# Altium project PCB_Project.PrjPcb (part 2 of 4)
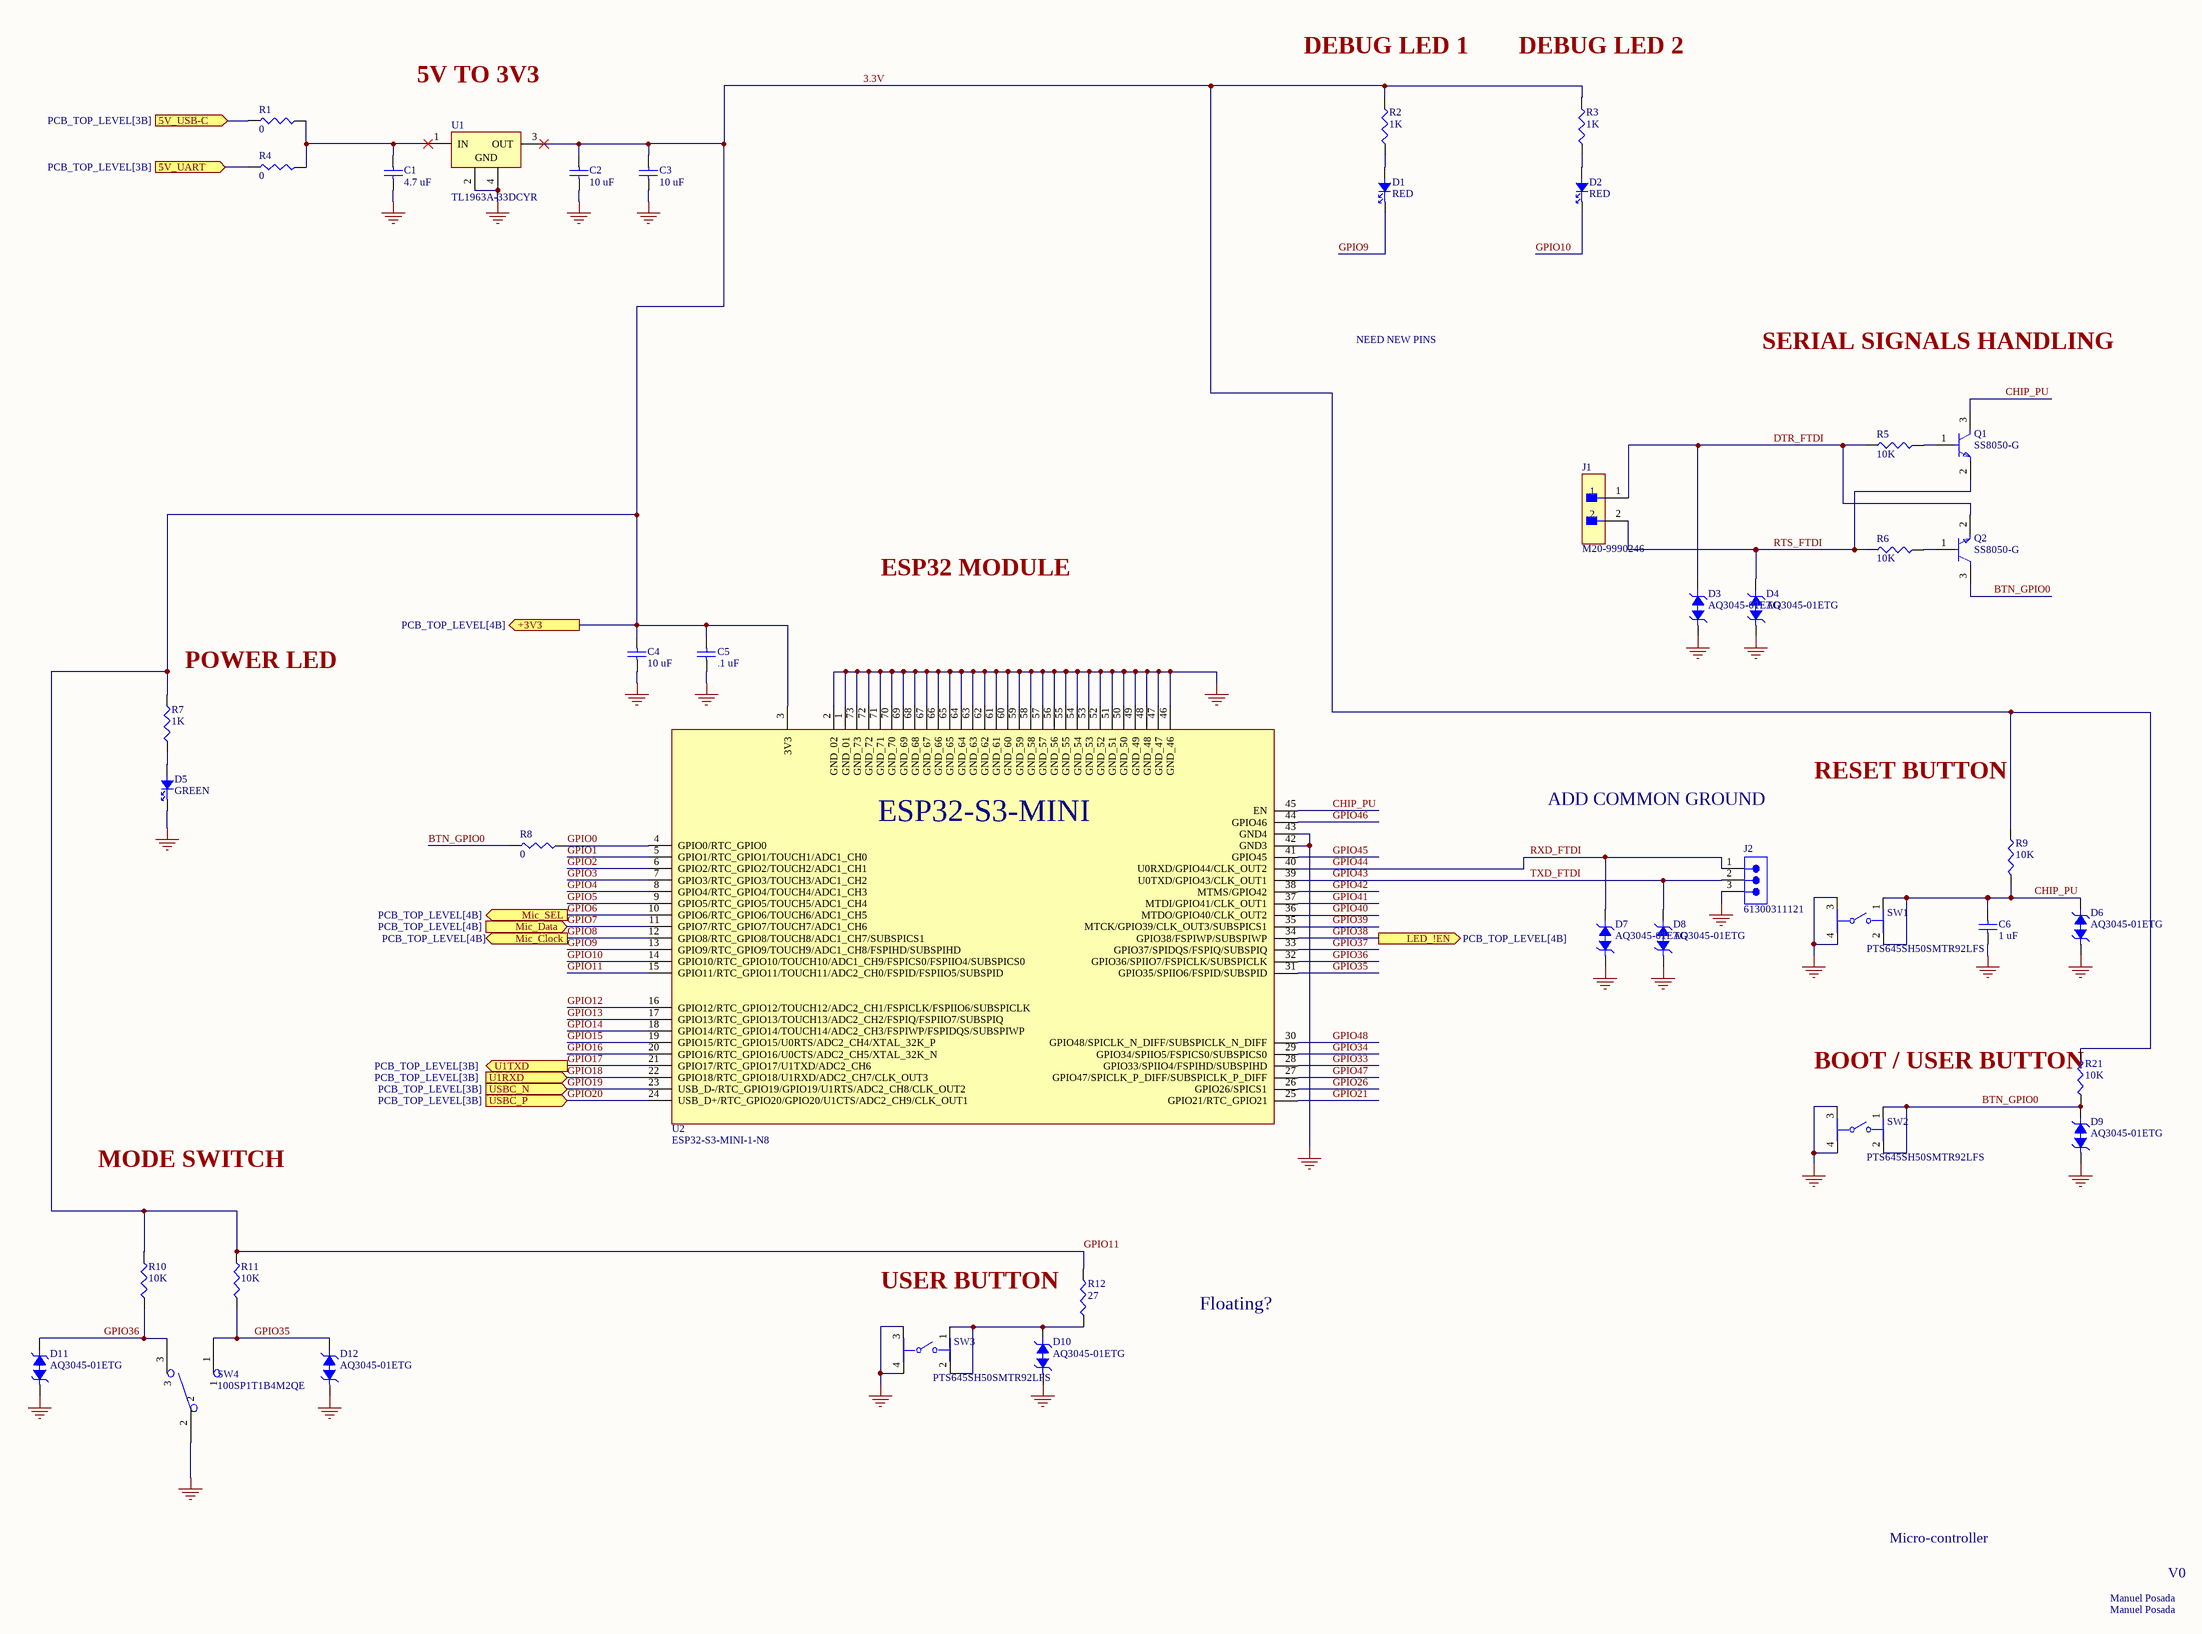
[diagram p6: Micro_controller.SchDoc]

## Sheet Micro_controller.SchDoc (continued)
### Library data of the parts
C1 = CL21A475KAQNNNE: 25V 4.7uF X5R ±10% 0805 Multilayer Ceramic Capacitors MLCC - SMD/SMT ROHS; Manufacturer: Samsung Electro-Mechanics; Value: 4.7µF; Supplier: DigiKey; Supplier Part Number: 1276-1244-6-ND; Manufacturer Part Number: CL21A475KAQNNNE; RoHS: Compliant; Category: Ceramic Capacitors; Stock: 1914384; Pricing: 1=0.1, 10=0.057, 50=0.039, 100=0.0337, 500=0.02474, 1000=0.02199 (USD); Case/Package: 0805; Case Code (Imperial): 0805; Case Code (Metric): 2012; China RoHS: Compliant; Country of Origin: Mainland China, Philippines, South Korea; Depth: 1.25mm; Dielectric: X5R; Dielectric Material: Ceramic; Export Control Classification Number (ECCN) Code: EAR99; Height: 1.4mm; Harmonized Tariff Schedule (HTS) Code: 8532.24.00.20; Introduction Date: 2009-10-29; Lead Free: Lead Free; Length: 2mm; Lifecycle Status: Production; Material: Ceramic; Max Operating Temperature: 85°C; Min Operating Temperature: -55°C; Mounting Technology: Surface Mount; Number of Terminals: 2; Packaging: Tape & Reel; Radiation Hardening: No; REACH SVHC: Yes; Schedule B: 8532240020, 8532240020|8532240020|8532240020|8532240020|8532240020|8532240020|8532240020|8532240020|8532240020|8532240020|8532240020|8532240020|8532240020, 8532240020|8532240020|8532240020|8532240020|8532240020|8532240020|8532240020|8532240020|8532240020|8532240020|8532240020|8532240020|8532240020|8532240020, 8532240020|8532240020|8532240020|8532240020|8532240020|8532240020|8532240020|8532240020|8532240020|8532240020|8532240020|8532240020|8532240020|8532240020|8532240020; Thickness: 1.397mm; Tolerance: 10%; Voltage Rating: 25V; Voltage Rating (DC): 25V; Width: 1.25mm; ComponentLink1URL: https://datasheet.octopart.com:443/CL21A475KAQNNNE-Samsung-Electro-Mechanics-datasheet-136322593.pdf?src-supplier=IHS; ComponentLink1Description: https://datasheet.octopart.com:443/CL21A475KAQNNNE-Samsung-Electro-Mechanics-datasheet-136322593.pdf?src-supplier=IHS; ComponentLink2URL: https://datasheet.octopart.com:443/CL21A475KAQNNNE-Samsung-Electro-Mechanics-datasheet-11797909.pdf?src-supplier=Future+Electronics; ComponentLink2Description: https://datasheet.octopart.com:443/CL21A475KAQNNNE-Samsung-Electro-Mechanics-datasheet-11797909.pdf?src-supplier=Future+Electronics; ComponentLink3URL: https://datasheet.octopart.com:443/CL21A475KAQNNNE-Samsung-Electro-Mechanics-datasheet-110333979.pdf?src-supplier=Future+Electronics; ComponentLink3Description: https://datasheet.octopart.com:443/CL21A475KAQNNNE-Samsung-Electro-Mechanics-datasheet-110333979.pdf?src-supplier=Future+Electronics; ComponentLink4URL: https://datasheet.octopart.com:443/CL21A475KAQNNNE-Samsung-Electro-Mechanics-datasheet-81462145.pdf?src-supplier=Future+Electronics; ComponentLink4Description: https://datasheet.octopart.com:443/CL21A475KAQNNNE-Samsung-Electro-Mechanics-datasheet-81462145.pdf?src-supplier=Future+Electronics; ComponentLink5URL: https://datasheet.octopart.com:443/CL21A475KAQNNNE-Samsung-datasheet-48647566.pdf?src-supplier=Future+Electronics; ComponentLink5Description: https://datasheet.octopart.com:443/CL21A475KAQNNNE-Samsung-datasheet-48647566.pdf?src-supplier=Future+Electronics; ComponentLink6URL: https://datasheet.octopart.com:443/CL21A475KAQNNNE-Samsung-datasheet-42485236.pdf?src-supplier=Future+Electronics; ComponentLink6Description: https://datasheet.octopart.com:443/CL21A475KAQNNNE-Samsung-datasheet-42485236.pdf?src-supplier=Future+Electronics; ComponentLink7URL: https://datasheet.octopart.com:443/CL21A475KAQNNNE-Samsung-Electro-Mechanics-datasheet-149154248.pdf?src-supplier=Future+Electronics; ComponentLink7Description: https://datasheet.octopart.com:443/CL21A475KAQNNNE-Samsung-Electro-Mechanics-datasheet-149154248.pdf?src-supplier=Future+Electronics; ComponentLink8URL: https://datasheet.octopart.com/CL21A475KAQNNNE-Samsung-Electro-Mechanics-datasheet-97040617.pdf; ComponentLink8Description: https://datasheet.octopart.com/CL21A475KAQNNNE-Samsung-Electro-Mechanics-datasheet-97040617.pdf; ComponentLink9URL: https://datasheet.octopart.com/CL21A475KAQNNNE-Samsung-Electro-Mechanics-datasheet-8324245.pdf; ComponentLink9Description: https://datasheet.octopart.com/CL21A475KAQNNNE-Samsung-Electro-Mechanics-datasheet-8324245.pdf; ComponentLink10URL: https://datasheet.octopart.com/General-Multilayer-Ceramic-Capacitors-Samsung-datasheet-family-111.pdf; ComponentLink10Description: https://datasheet.octopart.com/General-Multilayer-Ceramic-Capacitors-Samsung-datasheet-family-111.pdf; ComponentLink11URL: https://datasheet.octopart.com:443/CL21A475KAQNNNE-Samsung-datasheet-59220082.pdf?src-supplier=TME; ComponentLink11Description: https://datasheet.octopart.com:443/CL21A475KAQNNNE-Samsung-datasheet-59220082.pdf?src-supplier=TME; ComponentLink12URL: http://sigma.octopart.com:80/rohs_certificate/General-Multilayer-Ceramic-Capacitors-Samsung-family-110.pdf?src-supplier=Compliance+Statements; ComponentLink12Description: http://sigma.octopart.com:80/rohs_certificate/General-Multilayer-Ceramic-Capacitors-Samsung-family-110.pdf?src-supplier=Compliance+Statements; ComponentLink13URL: http://sigma.octopart.com:80/rohs_statement/General-Multilayer-Ceramic-Capacitors-Samsung-family-132.pdf?src-supplier=Compliance+Statements; ComponentLink13Description: http://sigma.octopart.com:80/rohs_statement/General-Multilayer-Ceramic-Capacitors-Samsung-family-132.pdf?src-supplier=Compliance+Statements; ComponentLink14URL: http://sigma.octopart.com:80/reach_statement/General-Multilayer-Ceramic-Capacitors-Samsung-family-133.pdf?src-supplier=Compliance+Statements; ComponentLink14Description: http://sigma.octopart.com:80/reach_statement/General-Multilayer-Ceramic-Capacitors-Samsung-family-133.pdf?src-supplier=Compliance+Statements
C2-C4 = CL21B106KOQNNNE: 16V 10uF X7R ±10% 0805 Multilayer Ceramic Capacitors MLCC - SMD/SMT ROHS; Manufacturer: Samsung Electro-Mechanics; Value: 10µF; Supplier: DigiKey; Supplier Part Number: 1276-2872-6-ND; Manufacturer Part Number: CL21B106KOQNNNE; RoHS: Compliant; Category: Ceramic Capacitors; Stock: 2199280; Pricing: 1=0.08, 10=0.035 (USD); Case/Package: 0805; Case Code (Imperial): 0805; Case Code (Metric): 2012; China RoHS: Compliant; Contact Plating: Tin; Country of Origin: Mainland China, Philippines, South Korea; Depth: 1.25mm; Dielectric: X7R; Dielectric Material: Ceramic; Export Control Classification Number (ECCN) Code: EAR99; Height: 1.4mm; Harmonized Tariff Schedule (HTS) Code: 8532.24.00.20; Introduction Date: 2010-04-09; Length: 2mm; Lifecycle Status: Production; Material: Ceramic; Max Operating Temperature: 125°C; Min Operating Temperature: -55°C; Mounting Technology: Surface Mount; Number of Terminals: 2; Radiation Hardening: No; REACH SVHC: Yes; Schedule B: 8532240020, 8532240020|8532240020, 8532240020|8532240020|8532240020, 8532240020|8532240020|8532240020|8532240020; Thickness: 1.397mm; Tolerance: 10%; Voltage: 16V; Voltage Rating: 16V; Voltage Rating (DC): 16V; Width: 1.25mm; ComponentLink1URL: https://datasheet.octopart.com:443/CL21B106KOQNNNE-Samsung-Electro-Mechanics-datasheet-136482503.pdf?src-supplier=IHS; ComponentLink1Description: https://datasheet.octopart.com:443/CL21B106KOQNNNE-Samsung-Electro-Mechanics-datasheet-136482503.pdf?src-supplier=IHS; ComponentLink2URL: https://datasheet.octopart.com:443/CL21B106KOQNNNE-Samsung-Electro-Mechanics-datasheet-116891046.pdf?src-supplier=Future+Electronics; ComponentLink2Description: https://datasheet.octopart.com:443/CL21B106KOQNNNE-Samsung-Electro-Mechanics-datasheet-116891046.pdf?src-supplier=Future+Electronics; ComponentLink3URL: https://datasheet.octopart.com:443/CL21B106KOQNNNE-Samsung-Electro-Mechanics-datasheet-81462191.pdf?src-supplier=Future+Electronics; ComponentLink3Description: https://datasheet.octopart.com:443/CL21B106KOQNNNE-Samsung-Electro-Mechanics-datasheet-81462191.pdf?src-supplier=Future+Electronics; ComponentLink4URL: https://datasheet.octopart.com:443/CL21B106KOQNNNE-Samsung-datasheet-12530662.pdf?src-supplier=Future+Electronics; ComponentLink4Description: https://datasheet.octopart.com:443/CL21B106KOQNNNE-Samsung-datasheet-12530662.pdf?src-supplier=Future+Electronics; ComponentLink5URL: https://datasheet.octopart.com:443/CL21B106KOQNNNE-Samsung-datasheet-26669285.pdf?src-supplier=Future+Electronics; ComponentLink5Description: https://datasheet.octopart.com:443/CL21B106KOQNNNE-Samsung-datasheet-26669285.pdf?src-supplier=Future+Electronics; ComponentLink6URL: https://datasheet.octopart.com:443/CL21B106KOQNNNE-Samsung-Electro-Mechanics-datasheet-149045986.pdf?src-supplier=Future+Electronics; ComponentLink6Description: https://datasheet.octopart.com:443/CL21B106KOQNNNE-Samsung-Electro-Mechanics-datasheet-149045986.pdf?src-supplier=Future+Electronics; ComponentLink7URL: https://datasheet.octopart.com/CL21B106KOQNNNE-Samsung-Electro-Mechanics-datasheet-97040617.pdf; ComponentLink7Description: https://datasheet.octopart.com/CL21B106KOQNNNE-Samsung-Electro-Mechanics-datasheet-97040617.pdf; ComponentLink8URL: https://datasheet.octopart.com/CL21B106KOQNNNE-Samsung-Electro-Mechanics-datasheet-8324245.pdf; ComponentLink8Description: https://datasheet.octopart.com/CL21B106KOQNNNE-Samsung-Electro-Mechanics-datasheet-8324245.pdf; ComponentLink9URL: https://datasheet.octopart.com:443/CL21B106KOQNNNE-Samsung-Electro-Mechanics-datasheet-11806859.pdf?src-supplier=Arrow+Electronics; ComponentLink9Description: https://datasheet.octopart.com:443/CL21B106KOQNNNE-Samsung-Electro-Mechanics-datasheet-11806859.pdf?src-supplier=Arrow+Electronics; ComponentLink10URL: https://datasheet.octopart.com:443/CL21B106KOQNNNE-Samsung-datasheet-8326407.pdf?src-supplier=TME; ComponentLink10Description: https://datasheet.octopart.com:443/CL21B106KOQNNNE-Samsung-datasheet-8326407.pdf?src-supplier=TME
C5 = CL21B104KBCNNNC: 50V 100nF X7R ±10% 0805 Multilayer Ceramic Capacitors MLCC - SMD/SMT ROHS; Manufacturer: Samsung Electro-Mechanics; Supplier: DigiKey; Supplier Part Number: 1276-1003-6-ND; Manufacturer Part Number: CL21B104KBCNNNC; RoHS: Compliant; Category: Ceramic Capacitors; Stock: 2859375; Pricing: 1=0.08, 10=0.006 (USD); Value: 100nF; Case/Package: 0805; Case Code (Imperial): 0805; Case Code (Metric): 2012; China RoHS: Compliant; Contact Plating: Tin; Country of Origin: Mainland China, Philippines, South Korea; Depth: 1.25mm; Dielectric: X7R; Dielectric Material: Ceramic; Export Control Classification Number (ECCN) Code: EAR99; Height: 950µm; Harmonized Tariff Schedule (HTS) Code: 8532.24.00.20; Introduction Date: 2009-07-27; Lead Free: Lead Free; Length: 2mm; Lifecycle Status: Production; Material: Ceramic; Max Operating Temperature: 125°C; Min Operating Temperature: -55°C; Mounting Technology: Surface Mount; Number of Terminals: 2; Radiation Hardening: No; REACH SVHC: Yes; Schedule B: 8532240020, 8532240020|8532240020, 8532240020|8532240020|8532240020, 8532240020|8532240020|8532240020|8532240020; Thickness: 939.8µm; Tolerance: 10%; Voltage: 50V; Voltage Rating: 50V; Voltage Rating (DC): 50V; Width: 1.25mm; ComponentLink1URL: https://datasheet.octopart.com:443/CL21B104KBCNNNC-Samsung-Electro-Mechanics-datasheet-137745078.pdf?src-supplier=IHS; ComponentLink1Description: https://datasheet.octopart.com:443/CL21B104KBCNNNC-Samsung-Electro-Mechanics-datasheet-137745078.pdf?src-supplier=IHS; ComponentLink2URL: https://datasheet.octopart.com/CL21B104KBCNNNC-Samsung-Electro-Mechanics-datasheet-8324245.pdf; ComponentLink2Description: https://datasheet.octopart.com/CL21B104KBCNNNC-Samsung-Electro-Mechanics-datasheet-8324245.pdf; ComponentLink3URL: https://datasheet.octopart.com/CL21B104KBCNNNC-Samsung-Electro-Mechanics-datasheet-97040617.pdf; ComponentLink3Description: https://datasheet.octopart.com/CL21B104KBCNNNC-Samsung-Electro-Mechanics-datasheet-97040617.pdf; ComponentLink4URL: https://datasheet.octopart.com:443/CL21B104KBCNNNC-Samsung-Electro-Mechanics-datasheet-11548950.pdf?src-supplier=Future+Electronics; ComponentLink4Description: https://datasheet.octopart.com:443/CL21B104KBCNNNC-Samsung-Electro-Mechanics-datasheet-11548950.pdf?src-supplier=Future+Electronics; ComponentLink5URL: https://datasheet.octopart.com:443/CL21B104KBCNNNC-Samsung-Electro-Mechanics-datasheet-116891032.pdf?src-supplier=Future+Electronics; ComponentLink5Description: https://datasheet.octopart.com:443/CL21B104KBCNNNC-Samsung-Electro-Mechanics-datasheet-116891032.pdf?src-supplier=Future+Electronics; ComponentLink6URL: https://datasheet.octopart.com:443/CL21B104KBCNNNC-Samsung-Electro-Mechanics-datasheet-81462175.pdf?src-supplier=Future+Electronics; ComponentLink6Description: https://datasheet.octopart.com:443/CL21B104KBCNNNC-Samsung-Electro-Mechanics-datasheet-81462175.pdf?src-supplier=Future+Electronics; ComponentLink7URL: https://datasheet.octopart.com:443/CL21B104KBCNNNC-Samsung-datasheet-42485244.pdf?src-supplier=Future+Electronics; ComponentLink7Description: https://datasheet.octopart.com:443/CL21B104KBCNNNC-Samsung-datasheet-42485244.pdf?src-supplier=Future+Electronics; ComponentLink8URL: https://datasheet.octopart.com:443/CL21B104KBCNNNC-Samsung-Electro-Mechanics-datasheet-149045937.pdf?src-supplier=Future+Electronics; ComponentLink8Description: https://datasheet.octopart.com:443/CL21B104KBCNNNC-Samsung-Electro-Mechanics-datasheet-149045937.pdf?src-supplier=Future+Electronics; ComponentLink9URL: https://datasheet.octopart.com:443/CL21B104KBCNNNC-Samsung-datasheet-8326407.pdf?src-supplier=TME; ComponentLink9Description: https://datasheet.octopart.com:443/CL21B104KBCNNNC-Samsung-datasheet-8326407.pdf?src-supplier=TME
C6 = CL21B105KBFNNNE: 50V 1uF X7R ±10% 0805 Multilayer Ceramic Capacitors MLCC - SMD/SMT ROHS; Manufacturer: Samsung Electro-Mechanics; Value: 1µF; Supplier: DigiKey; Supplier Part Number: 1276-1029-6-ND; Manufacturer Part Number: CL21B105KBFNNNE; RoHS: Compliant; Category: Ceramic Capacitors; Stock: 1740686; Pricing: 1=0.08, 10=0.013 (USD); Case/Package: 0805; Case Code (Imperial): 0805; Case Code (Metric): 2012; China RoHS: Compliant; Country of Origin: Mainland China, Philippines, South Korea; Depth: 1.25mm; Dielectric: X7R; Dielectric Material: Ceramic; Export Control Classification Number (ECCN) Code: EAR99; Height: 1.35mm; Harmonized Tariff Schedule (HTS) Code: 8532.24.00.20; Introduction Date: 2010-07-30; Length: 2mm; Lifecycle Status: Production; Material: Ceramic; Max Operating Temperature: 125°C; Min Operating Temperature: -55°C; Mounting Technology: Surface Mount; Number of Terminals: 2; Radiation Hardening: No; REACH SVHC: Yes; Schedule B: 8532240020, 8532240020|8532240020, 8532240020|8532240020|8532240020, 8532240020|8532240020|8532240020|8532240020; Thickness: 1.3462mm; Tolerance: 10%; Voltage: 50V; Voltage Rating: 50V; Voltage Rating (DC): 50V; Width: 1.25mm; ComponentLink1URL: https://datasheet.octopart.com:443/CL21B105KBFNNNE-Samsung-Electro-Mechanics-datasheet-136482495.pdf?src-supplier=IHS; ComponentLink1Description: https://datasheet.octopart.com:443/CL21B105KBFNNNE-Samsung-Electro-Mechanics-datasheet-136482495.pdf?src-supplier=IHS; ComponentLink2URL: https://datasheet.octopart.com:443/CL21B105KBFNNNE-Samsung-Electro-Mechanics-datasheet-11733377.pdf?src-supplier=Future+Electronics; ComponentLink2Description: https://datasheet.octopart.com:443/CL21B105KBFNNNE-Samsung-Electro-Mechanics-datasheet-11733377.pdf?src-supplier=Future+Electronics; ComponentLink3URL: https://datasheet.octopart.com:443/CL21B105KBFNNNE-Samsung-Electro-Mechanics-datasheet-116891038.pdf?src-supplier=Future+Electronics; ComponentLink3Description: https://datasheet.octopart.com:443/CL21B105KBFNNNE-Samsung-Electro-Mechanics-datasheet-116891038.pdf?src-supplier=Future+Electronics; ComponentLink4URL: https://datasheet.octopart.com:443/CL21B105KBFNNNE-Samsung-Electro-Mechanics-datasheet-81462183.pdf?src-supplier=Future+Electronics; ComponentLink4Description: https://datasheet.octopart.com:443/CL21B105KBFNNNE-Samsung-Electro-Mechanics-datasheet-81462183.pdf?src-supplier=Future+Electronics; ComponentLink5URL: https://datasheet.octopart.com:443/CL21B105KBFNNNE-Samsung-datasheet-48647582.pdf?src-supplier=Future+Electronics; ComponentLink5Description: https://datasheet.octopart.com:443/CL21B105KBFNNNE-Samsung-datasheet-48647582.pdf?src-supplier=Future+Electronics; ComponentLink6URL: https://datasheet.octopart.com:443/CL21B105KBFNNNE-Samsung-datasheet-8326294.pdf?src-supplier=Future+Electronics; ComponentLink6Description: https://datasheet.octopart.com:443/CL21B105KBFNNNE-Samsung-datasheet-8326294.pdf?src-supplier=Future+Electronics; ComponentLink7URL: https://datasheet.octopart.com:443/CL21B105KBFNNNE-Samsung-Electro-Mechanics-datasheet-149045959.pdf?src-supplier=Future+Electronics; ComponentLink7Description: https://datasheet.octopart.com:443/CL21B105KBFNNNE-Samsung-Electro-Mechanics-datasheet-149045959.pdf?src-supplier=Future+Electronics; ComponentLink8URL: https://datasheet.octopart.com/CL21B105KBFNNNE-Samsung-Electro-Mechanics-datasheet-97040617.pdf; ComponentLink8Description: https://datasheet.octopart.com/CL21B105KBFNNNE-Samsung-Electro-Mechanics-datasheet-97040617.pdf; ComponentLink9URL: https://datasheet.octopart.com/CL21B105KBFNNNE-Samsung-Electro-Mechanics-datasheet-8324245.pdf; ComponentLink9Description: https://datasheet.octopart.com/CL21B105KBFNNNE-Samsung-Electro-Mechanics-datasheet-8324245.pdf; ComponentLink10URL: https://datasheet.octopart.com/General-Multilayer-Ceramic-Capacitors-Samsung-datasheet-family-111.pdf; ComponentLink10Description: https://datasheet.octopart.com/General-Multilayer-Ceramic-Capacitors-Samsung-datasheet-family-111.pdf; ComponentLink11URL: https://datasheet.octopart.com:443/CL21B105KBFNNNE-Samsung-datasheet-59220082.pdf?src-supplier=TME; ComponentLink11Description: https://datasheet.octopart.com:443/CL21B105KBFNNNE-Samsung-datasheet-59220082.pdf?src-supplier=TME; ComponentLink12URL: http://sigma.octopart.com:80/rohs_certificate/General-Multilayer-Ceramic-Capacitors-Samsung-family-110.pdf?src-supplier=Compliance+Statements; ComponentLink12Description: http://sigma.octopart.com:80/rohs_certificate/General-Multilayer-Ceramic-Capacitors-Samsung-family-110.pdf?src-supplier=Compliance+Statements; ComponentLink13URL: http://sigma.octopart.com:80/rohs_statement/General-Multilayer-Ceramic-Capacitors-Samsung-family-132.pdf?src-supplier=Compliance+Statements; ComponentLink13Description: http://sigma.octopart.com:80/rohs_statement/General-Multilayer-Ceramic-Capacitors-Samsung-family-132.pdf?src-supplier=Compliance+Statements; ComponentLink14URL: http://sigma.octopart.com:80/reach_statement/General-Multilayer-Ceramic-Capacitors-Samsung-family-133.pdf?src-supplier=Compliance+Statements; ComponentLink14Description: http://sigma.octopart.com:80/reach_statement/General-Multilayer-Ceramic-Capacitors-Samsung-family-133.pdf?src-supplier=Compliance+Statements
D1 D2 = VLMS1500-GS08: LED RED 0402 SMD; Manufacturer: Vishay; Shape: Rectangular; Forward Current: 30mA; Forward Voltage: 2.4V; Luminous Intensity-Nom: 54mcd; Channels: 1; Optoelectronic Device Type: SINGLE COLOR LED; Reverse Voltage-Max: 5V; Viewing Angle: 130°; Overall Height: 0.35mm; Supplier: Digikey; Supplier Part Number: VLMS1500-GS08CT-ND; Manufacturer Part Number: VLMS1500-GS08; RoHS: Yes; Category: LEDs; Stock: 70376; Pricing: 1=0.34, 10=0.265, 100=0.119, 500=0.10746, 1000=0.08827 (USD); Mounting Technology: Surface Mount; Pins: 2; Color: Red; Color@wavelength: Red; Min Operating Temperature: -30°C; Max Operating Temperature: 85°C; Packaging: Tape and Reel; Size: 0.5mm; Terminal Pitch: 0.95mm; Reach SVHC Compliant: Yes; RoHS Compliant: Yes; ComponentLink1URL: https://datasheet.ciiva.com:443/pdfs/VipMasterIC/IC/VISH/VISH-S-A0003457490/VISH-S-A0003457490-1.pdf?src-supplier=IHS+Markit; ComponentLink1Description: https://datasheet.ciiva.com:443/pdfs/VipMasterIC/IC/VISH/VISH-S-A0003457490/VISH-S-A0003457490-1.pdf?src-supplier=IHS+Markit; ComponentLink2URL: http://www.farnell.com/datasheets/1809983.pdf?src-supplier=Farnell; ComponentLink2Description: http://www.farnell.com/datasheets/1809983.pdf?src-supplier=Farnell; ComponentLink3URL: http://www.mouser.com/ds/2/427/vlmo1500-244705.pdf?src-supplier=Mouser; ComponentLink3Description: http://www.mouser.com/ds/2/427/vlmo1500-244705.pdf?src-supplier=Mouser; ComponentLink4URL: https://datasheet.octopart.com/VLMS1500-GS08-Vishay-datasheet-62332426.pdf?src-supplier=Newark; ComponentLink4Description: https://datasheet.octopart.com/VLMS1500-GS08-Vishay-datasheet-62332426.pdf?src-supplier=Newark; ComponentLink5URL: https://datasheet.octopart.com/VLMS1500-GS08-Vishay-datasheet-33014519.pdf?src-supplier=Element14; ComponentLink5Description: https://datasheet.octopart.com/VLMS1500-GS08-Vishay-datasheet-33014519.pdf?src-supplier=Element14; ComponentLink6URL: http://datasheet.octopart.com/VLMS1500-GS08-Vishay-datasheet-21227148.pdf?src-supplier=Avnet; ComponentLink6Description: http://datasheet.octopart.com/VLMS1500-GS08-Vishay-datasheet-21227148.pdf?src-supplier=Avnet; ComponentLink7URL: http://www.farnell.com/datasheets/1809983.pdf?src-supplier=Newark; ComponentLink7Description: http://www.farnell.com/datasheets/1809983.pdf?src-supplier=Newark; ComponentLink8URL: http://www.farnell.com/datasheets/2050839.pdf?src-supplier=Newark; ComponentLink8Description: http://www.farnell.com/datasheets/2050839.pdf?src-supplier=Newark; ComponentLink9URL: http://datasheet.octopart.com/VLMS1500-GS08-Vishay-datasheet-21227148.pdf?src-supplier=Quest; ComponentLink9Description: http://datasheet.octopart.com/VLMS1500-GS08-Vishay-datasheet-21227148.pdf?src-supplier=Quest; ComponentLink10URL: http://datasheet.octopart.com/VLMS1500-GS08-Vishay-datasheet-21227148.pdf?src-supplier=NAC+Semi; ComponentLink10Description: http://datasheet.octopart.com/VLMS1500-GS08-Vishay-datasheet-21227148.pdf?src-supplier=NAC+Semi; LCSC Part Number: C511370
D3 D4 D6-D12 = AQ3045-01ETG: TVS DIODE 5.3VWM 12VC SOD882; Manufacturer: Littelfuse; Diode Element Material: SILICON; Package Body Material: Plastic; Polarity: Bidirectional; Max Breakdown Voltage: 9V; Min Breakdown Voltage: 6.8V; Diode Type: TRANS VOLTAGE SUPPRESSOR; Non-rep Peak Rev Power Dis-Max: 40W; Number of Elements: 1; Rep Pk Reverse Voltage-Max: 5.3V; Reference Standard: AEC-Q101; Supplier: Digikey; Supplier Part Number: F9321CT-ND; Manufacturer Part Number: AQ3045-01ETG; RoHS: Yes; Category: TVS Diodes; Stock: 21664; Pricing: 1=0.5, 10=0.391, 100=0.2344, 500=0.217, 1000=0.14756, 2000=0.13585, 5000=0.1302 (USD); Pins: 2; Package Shape: Rectangular; Min Operating Temperature: -55°C; Max Operating Temperature: 150°C; Package Style: CHIP CARRIERMeter; Surface Mount: Yes; Technology: AVALANCHE; Terminal Form: No Lead; Terminal Position: BOTTOM; Reach SVHC Compliant: Yes; RoHS Compliant: Yes; ComponentLink1URL: https://datasheet.ciiva.com:443/pdfs/VipMasterIC/IC/LFSI/LFSI-S-A0007892042/LFSI-S-A0007892042-1.pdf?src-supplier=IHS+Markit; ComponentLink1Description: https://datasheet.ciiva.com:443/pdfs/VipMasterIC/IC/LFSI/LFSI-S-A0007892042/LFSI-S-A0007892042-1.pdf?src-supplier=IHS+Markit; ComponentLink2URL: https://www.littelfuse.com/~/media/electronics/datasheets/tvs_diode_arrays/littelfuse_tvs_diode_array_aq3045_datasheet.pdf.pdf?src-supplier=Digikey; ComponentLink2Description: https://www.littelfuse.com/~/media/electronics/datasheets/tvs_diode_arrays/littelfuse_tvs_diode_array_aq3045_datasheet.pdf.pdf?src-supplier=Digikey; ComponentLink3URL: http://www.littelfuse.com/~/media/electronics/datasheets/tvs_diode_arrays/littelfuse_tvs_diode_array_aq3045_datasheet.pdf.pdf?src-supplier=Digikey; ComponentLink3Description: http://www.littelfuse.com/~/media/electronics/datasheets/tvs_diode_arrays/littelfuse_tvs_diode_array_aq3045_datasheet.pdf.pdf?src-supplier=Digikey; LCSC Part Number: C3710326
D5 = VLMG1500-GS08: LED YLW-GRN 0402 SMD; Manufacturer: Vishay; Color: Green,Yellow; Lens Color: Clear; Viewing Angle: 130°; Forward Current: 30mA; Forward Voltage: 2V; Luminous Intensity: 35mcd; Dominant Wavelength: 571nm; Test Current: 20mA; Number of Elements: 1; Power Dissipation: 75mW; Lens Style: Rectangular; Reverse Voltage: 5V; Supplier: Digikey; Supplier Part Number: VLMG1500-GS08CT-ND; Manufacturer Part Number: VLMG1500-GS08; RoHS: Yes; Category: LEDs; Stock: 98; Pricing: 1=0.34, 10=0.265, 100=0.119, 500=0.10746, 1000=0.08827 (USD); Mounting Technology: Surface Mount; Case/Package: 0402; Pins: 2; Case Code (Metric): 1005; Case Code (Imperial): 0402; Min Operating Temperature: -30°C; Max Operating Temperature: 85°C; Package Quantity: 1; Packaging: Tape and Reel; Illumination Color: Green; Wavelength: 571nm; Number of LEDs: 1; Power Rating: 75mW; Series: CHipLED; Length: 1mm; Width: 0.5mm; Height: 0.35mm; Depth: 0.5mm; Radiation Hardening: No; Lead Free: Lead Free; RoHS Compliant: Yes; Reach SVHC Compliant: Unknown; ComponentLink1URL: https://datasheet.ciiva.com/12071/vlmo1500-244705-12071911.pdf?src-supplier=Mouser; ComponentLink1Description: https://datasheet.ciiva.com/12071/vlmo1500-244705-12071911.pdf?src-supplier=Mouser; ComponentLink2URL: https://datasheet.ciiva.com/30005/vlmo1500-30005134.pdf?src-supplier=Avnet; ComponentLink2Description: https://datasheet.ciiva.com/30005/vlmo1500-30005134.pdf?src-supplier=Avnet; LCSC Part Number: C511404
J1 = M20-9990246: Connector Header Through Hole 2 position 0.100" (2.54mm); Manufacturer: Harwin; Connector Type: Male Pin; Contact Resistance: 30mΩ; Current Rating: 3A; Dielectric Material: Polyamide; Gender: Male; Insulation Resistance: 1GΩ; Number of Contacts: 2; Voltage Rating (AC): 750V; Supplier: DigiKey; Supplier Part Number: 952-2262-ND; Manufacturer Part Number: M20-9990246; RoHS: Compliant; Category: Headers and Wire Housings; Stock: 177211; Pricing: 1=0.1, 10=0.079, 100=0.0669, 500=0.0597, 1000=0.05684, 5000=0.05073, 10000=0.04831 (USD); Case/Package: SIL; Color: Black; Contact Gender: Male; Contact Material: Brass; Contact Mating Length: 6.096mm; Contact Plating: Tin; Country of Origin: Taiwan; Depth: 2.54mm; Export Control Classification Number (ECCN) Code: EAR99; Height: 8.99mm; Housing Color: Black; Housing Material: Nylon; Harmonized Tariff Schedule (HTS) Code: 8536.69.40.40; Introduction Date: 2005-06-27; Lead Pitch: 2.54mm; Length: 5.08mm; Lifecycle Status: Production; Max Current Rating: 3A; Max Operating Temperature: 105°C; Min Operating Temperature: -40°C; Mounting Technology: Through Hole; Pins: 2; Number of Positions: 2; Number of Rows: 1; Orientation: Straight; Packaging: Bulk; Pitch: 2.54mm; Radiation Hardening: No; REACH SVHC: Yes; Terminal Pitch: 2.54mm; Termination: Solder; ComponentLink1URL: https://datasheet.octopart.com:443/M20-9990246-Harwin-datasheet-169407857.pdf?src-supplier=Newark; ComponentLink1Description: https://datasheet.octopart.com:443/M20-9990246-Harwin-datasheet-169407857.pdf?src-supplier=Newark; ComponentLink2URL: https://datasheet.octopart.com:443/M20-9990246-Harwin-datasheet-27378916.pdf?src-supplier=Newark; ComponentLink2Description: https://datasheet.octopart.com:443/M20-9990246-Harwin-datasheet-27378916.pdf?src-supplier=Newark; ComponentLink3URL: https://datasheet.octopart.com:443/M20-9990246-Harwin-datasheet-96624206.pdf?src-supplier=element14+APAC; ComponentLink3Description: https://datasheet.octopart.com:443/M20-9990246-Harwin-datasheet-96624206.pdf?src-supplier=element14+APAC; ComponentLink4URL: https://datasheet.octopart.com:443/M20-9990246-Harwin-datasheet-32864541.pdf?src-supplier=Farnell; ComponentLink4Description: https://datasheet.octopart.com:443/M20-9990246-Harwin-datasheet-32864541.pdf?src-supplier=Farnell; ComponentLink5URL: https://datasheet.octopart.com:443/M20-9990246-Harwin-datasheet-7538443.pdf?src-supplier=Farnell; ComponentLink5Description: https://datasheet.octopart.com:443/M20-9990246-Harwin-datasheet-7538443.pdf?src-supplier=Farnell; ComponentLink6URL: https://datasheet.octopart.com:443/M20-9990246-Harwin-datasheet-508868.pdf?src-supplier=Farnell; ComponentLink6Description: https://datasheet.octopart.com:443/M20-9990246-Harwin-datasheet-508868.pdf?src-supplier=Farnell
J2 = 61300311121: WR-PHD Straight Male, PCB Header, Through Hole, 1 Rows, 3 Contacts, 2.54mm Pitch; Manufacturer: Wurth Elektronik; Connector Type: Male Pin; Contact Resistance: 20mΩ; Current Rating: 3A; Insulation Resistance: 1GΩ; Number of Contacts: 3; Operating Supply Voltage: 250V; Supplier: Newark; Supplier Part Number: 61300311121; Manufacturer Part Number: 61300311121; RoHS: Compliant; Category: Headers and Wire Housings; Stock: 1092; Pricing: 100=0.087, 500=0.086, 1000=0.084 (USD); Color: Black; Contact Material: Gold; Contact Mating Length: 5.9944mm; Contact Plating: Gold; Gender: Male; Height: 8.94mm; Lead Free: Lead Free; Lead Pitch: 2.54mm; Length: 7.62mm; Max Operating Temperature: 105°C; Min Operating Temperature: -40°C; Mounting Technology: Through Hole; Pins: 3; Number of Positions: 3; Number of Rows: 1; Orientation: Vertical; Packaging: Bulk; Pitch: 2.54mm; Termination: Solder; Voltage Rating: 250V; ComponentLink1URL: https://datasheet.octopart.com:443/61300311121-Wurth-Elektronik-datasheet-168684096.pdf?src-supplier=Wurth+Elektronik; ComponentLink1Description: https://datasheet.octopart.com:443/61300311121-Wurth-Elektronik-datasheet-168684096.pdf?src-supplier=Wurth+Elektronik; ComponentLink2URL: https://datasheet.octopart.com:443/61300311121-W%C3%BCrth-Elektronik-datasheet-44382959.pdf?src-supplier=Future+Electronics; ComponentLink2Description: https://datasheet.octopart.com:443/61300311121-W%C3%BCrth-Elektronik-datasheet-44382959.pdf?src-supplier=Future+Electronics; ComponentLink3URL: https://datasheet.octopart.com:443/61300311121-W%C3%BCrth-Elektronik-datasheet-149524047.pdf?src-supplier=Farnell; ComponentLink3Description: https://datasheet.octopart.com:443/61300311121-W%C3%BCrth-Elektronik-datasheet-149524047.pdf?src-supplier=Farnell; ComponentLink4URL: https://datasheet.octopart.com:443/61300311121-W%C3%BCrth-Elektronik-datasheet-21154836.pdf?src-supplier=element14+APAC; ComponentLink4Description: https://datasheet.octopart.com:443/61300311121-W%C3%BCrth-Elektronik-datasheet-21154836.pdf?src-supplier=element14+APAC
Q1 Q2 = SS8050-G: TRANS NPN 25V 1.5A SOT23-3; Manufacturer: Comchip; Supplier: Digikey; Supplier Part Number: 641-1790-1-ND; Manufacturer Part Number: SS8050-G; RoHS: Yes; Category: Transistors; Stock: 108568; Pricing: 1=0.29, 10=0.2, 100=0.0978, 500=0.08154, 1000=0.05666 (USD); Reach SVHC Compliant: Yes; RoHS Compliant: Yes; ComponentLink1URL: https://datasheet.ciiva.com:443/pdfs/VipMasterIC/IC/COMC/COMC-S-A0004994192/COMC-S-A0004994192-1.pdf?src-supplier=IHS+Markit; ComponentLink1Description: https://datasheet.ciiva.com:443/pdfs/VipMasterIC/IC/COMC/COMC-S-A0004994192/COMC-S-A0004994192-1.pdf?src-supplier=IHS+Markit; ComponentLink2URL: http://www.comchiptech.com/admin/files/product/SS8050-G RevA181526.pdf?src-supplier=Digikey; ComponentLink2Description: http://www.comchiptech.com/admin/files/product/SS8050-G RevA181526.pdf?src-supplier=Digikey; LCSC Part Number: C164886
R1 R4 R8 = RC0805JR-070RL: GENERAL PURPOSE CHIP RESISTOR Metal Glaze/thick Film, 0.125W, 0ohm, Surface Mount, 0805; Manufacturer: Yageo Group; Power Dissipation: 125mW; Value: 0Ω; Temperature Coefficient: 300ppm/°C; Tolerance: 5%; Voltage Rating: 150V; Supplier: DigiKey; Supplier Part Number: 311-0.0ARDKR-ND; Manufacturer Part Number: RC0805JR-070RL; RoHS: Compliant; Category: Chip SMD Resistors; Stock: 1260777; Pricing: 1=0.1, 10=0.015, 25=0.0128, 50=0.011, 100=0.0097, 250=0.00812, 500=0.00716, 1000=0.00633 (USD); Case/Package: 0805; Case Code (Imperial): 0805; China RoHS: Non-Compliant; Composition: Thick Film; Contact Plating: Tin; Depth: 1.25mm; Height: 500µm; Lead Free: Lead Free; Length: 2mm; Lifecycle Status: Production; Max Operating Temperature: 155°C; Military Standard: Not; Min Operating Temperature: -55°C; Mounting Technology: Surface Mount; Pins: 2; Number of Terminals: 2; Packaging: Tape & Reel; Power Rating: 125mW; Radiation Hardening: No; REACH SVHC: Yes; Schedule B: 8533290000, 8533290000|8533290000, 8533290000|8533290000|8533290000, 8533290000|8533290000|8533290000|8533290000; Termination: SMD/SMT; Voltage Rating (DC): 150V; Width: 1.25mm; ComponentLink1URL: https://datasheet.octopart.com:443/RC0805JR-070RL-Yageo-datasheet-182189538.pdf?src-supplier=IHS; ComponentLink1Description: https://datasheet.octopart.com:443/RC0805JR-070RL-Yageo-datasheet-182189538.pdf?src-supplier=IHS; ComponentLink2URL: https://datasheet.octopart.com:443/RC0805JR-070RL-Yageo-datasheet-103092701.pdf?src-supplier=Upverter; ComponentLink2Description: https://datasheet.octopart.com:443/RC0805JR-070RL-Yageo-datasheet-103092701.pdf?src-supplier=Upverter; ComponentLink3URL: https://datasheet.octopart.com:443/RC0805JR-070RL-Yageo-datasheet-98239111.pdf?src-supplier=Upverter; ComponentLink3Description: https://datasheet.octopart.com:443/RC0805JR-070RL-Yageo-datasheet-98239111.pdf?src-supplier=Upverter; ComponentLink4URL: https://datasheet.octopart.com:443/RC0805JR-070RL-Yageo-datasheet-8330313.pdf?src-supplier=Newark; ComponentLink4Description: https://datasheet.octopart.com:443/RC0805JR-070RL-Yageo-datasheet-8330313.pdf?src-supplier=Newark; ComponentLink5URL: https://datasheet.octopart.com:443/RC0805JR-070RL-Yageo-datasheet-8327506.pdf?src-supplier=Newark; ComponentLink5Description: https://datasheet.octopart.com:443/RC0805JR-070RL-Yageo-datasheet-8327506.pdf?src-supplier=Newark; ComponentLink6URL: https://datasheet.octopart.com:443/RC0805JR-070RL-Yageo-datasheet-62067350.pdf?src-supplier=element14+APAC; ComponentLink6Description: https://datasheet.octopart.com:443/RC0805JR-070RL-Yageo-datasheet-62067350.pdf?src-supplier=element14+APAC; ComponentLink7URL: https://datasheet.octopart.com:443/RC0805JR-070RL-Yageo-datasheet-17879891.pdf?src-supplier=element14+APAC; ComponentLink7Description: https://datasheet.octopart.com:443/RC0805JR-070RL-Yageo-datasheet-17879891.pdf?src-supplier=element14+APAC; ComponentLink8URL: https://datasheet.octopart.com:443/RC0805JR-070RL-Yageo-Group-datasheet-176638170.pdf?src-supplier=Future+Electronics; ComponentLink8Description: https://datasheet.octopart.com:443/RC0805JR-070RL-Yageo-Group-datasheet-176638170.pdf?src-supplier=Future+Electronics; ComponentLink9URL: https://datasheet.octopart.com:443/RC0805JR-070RL-Yageo-datasheet-164759695.pdf?src-supplier=Future+Electronics; ComponentLink9Description: https://datasheet.octopart.com:443/RC0805JR-070RL-Yageo-datasheet-164759695.pdf?src-supplier=Future+Electronics; ComponentLink10URL: https://datasheet.octopart.com:443/RC0805JR-070RL-Yageo-datasheet-15800360.pdf?src-supplier=Future+Electronics; ComponentLink10Description: https://datasheet.octopart.com:443/RC0805JR-070RL-Yageo-datasheet-15800360.pdf?src-supplier=Future+Electronics; ComponentLink11URL: https://datasheet.octopart.com:443/RC0805JR-070RL-Yageo-datasheet-12592811.pdf?src-supplier=Future+Electronics; ComponentLink11Description: https://datasheet.octopart.com:443/RC0805JR-070RL-Yageo-datasheet-12592811.pdf?src-supplier=Future+Electronics; ComponentLink12URL: https://datasheet.octopart.com:443/RC0805JR-070RL-Yageo-datasheet-8324252.pdf?src-supplier=Future+Electronics; ComponentLink12Description: https://datasheet.octopart.com:443/RC0805JR-070RL-Yageo-datasheet-8324252.pdf?src-supplier=Future+Electronics; ComponentLink13URL: https://datasheet.octopart.com:443/RC0805JR-070RL-Yageo-datasheet-79472498.pdf?src-supplier=Megastar; ComponentLink13Description: https://datasheet.octopart.com:443/RC0805JR-070RL-Yageo-datasheet-79472498.pdf?src-supplier=Megastar; ComponentLink14URL: https://datasheet.octopart.com/RC0805JR-070RL-Yageo-datasheet-73766026.pdf; ComponentLink14Description: https://datasheet.octopart.com/RC0805JR-070RL-Yageo-datasheet-73766026.pdf; ComponentLink15URL: https://datasheet.octopart.com:443/RC0805JR-070RL-Yageo-datasheet-8377918.pdf?src-supplier=Farnell; ComponentLink15Description: https://datasheet.octopart.com:443/RC0805JR-070RL-Yageo-datasheet-8377918.pdf?src-supplier=Farnell; ComponentLink16URL: https://datasheet.octopart.com:443/RC0805JR-070RL-Yageo-datasheet-118657.pdf?src-supplier=DigiKey; ComponentLink16Description: https://datasheet.octopart.com:443/RC0805JR-070RL-Yageo-datasheet-118657.pdf?src-supplier=DigiKey; ComponentLink17URL: http://sigma.octopart.com:80/conflict_mineral_statement/Yageo-company-3.pdf?src-supplier=Compliance+Statements; ComponentLink17Description: http://sigma.octopart.com:80/conflict_mineral_statement/Yageo-company-3.pdf?src-supplier=Compliance+Statements; ComponentLink18URL: http://sigma.octopart.com:80/rohs_statement/Yageo-company-2.pdf?src-supplier=Compliance+Statements; ComponentLink18Description: http://sigma.octopart.com:80/rohs_statement/Yageo-company-2.pdf?src-supplier=Compliance+Statements
R2 R3 R7 = RG2012P-102-B-T5: Res Thin Film 0805 1K Ohm 0.1% 0.125W(1/8W) ±25ppm/C Sulfur Resistant Pad SMD Automotive T/R; Manufacturer: Susumu; Max Power Dissipation: 125mW; Value: 1kΩ; Temperature Coefficient: 25ppm/°C; Voltage Rating: 150V; Supplier: DigiKey; Supplier Part Number: RG20P1.0KBCT-ND; Manufacturer Part Number: RG2012P-102-B-T5; RoHS: Compliant; Category: Chip SMD Resistors; Stock: 185368; Pricing: 1=0.1, 10=0.069, 25=0.0644, 50=0.0608, 100=0.0574, 250=0.05324, 500=0.05038, 1000=0.04774 (USD); Case/Package: 0805; Case Code (Imperial): 0805; Case Code (Metric): 2012; Composition: Thin Film; Country of Origin: Mainland China, Japan; Export Control Classification Number (ECCN) Code: EAR99; Features: Automotive AEC-Q200; Height: 400µm; Harmonized Tariff Schedule (HTS) Code: 8533.21.00.30; Introduction Date: 2006-03-30; Lead Free: Lead Free; Length: 2.0066mm; Lifecycle Status: Production; Max Operating Temperature: 155°C; Min Operating Temperature: -55°C; Mounting Technology: Surface Mount; Number of Terminals: 2; Number of Terminations: 2; Power Dissipation: 125mW; Power Rating: 125mW; REACH SVHC: Yes; Termination: SMD/SMT; Tolerance: 0.1%; Voltage Rating (DC): 150V; Width: 1.25mm; Working Voltage: 150V; ComponentLink1URL: https://datasheet.octopart.com:443/RG2012P-102-B-T5-Susumu-datasheet-182148308.pdf?src-supplier=IHS; ComponentLink1Description: https://datasheet.octopart.com:443/RG2012P-102-B-T5-Susumu-datasheet-182148308.pdf?src-supplier=IHS; ComponentLink2URL: https://datasheet.octopart.com:443/RG2012P-102-B-T5-Susumu-datasheet-104167497.pdf?src-supplier=Upverter; ComponentLink2Description: https://datasheet.octopart.com:443/RG2012P-102-B-T5-Susumu-datasheet-104167497.pdf?src-supplier=Upverter; ComponentLink3URL: https://datasheet.octopart.com:443/RG2012P-102-B-T5-Susumu-datasheet-62085167.pdf?src-supplier=Upverter; ComponentLink3Description: https://datasheet.octopart.com:443/RG2012P-102-B-T5-Susumu-datasheet-62085167.pdf?src-supplier=Upverter; ComponentLink4URL: https://datasheet.octopart.com/RG2012P-102-B-T5-Susumu-datasheet-12509734.pdf; ComponentLink4Description: https://datasheet.octopart.com/RG2012P-102-B-T5-Susumu-datasheet-12509734.pdf; ComponentLink5URL: https://datasheet.octopart.com:443/RG2012P-102-B-T5-Susumu-datasheet-12510102.pdf?src-supplier=Future+Electronics; ComponentLink5Description: https://datasheet.octopart.com:443/RG2012P-102-B-T5-Susumu-datasheet-12510102.pdf?src-supplier=Future+Electronics; ComponentLink6URL: https://datasheet.octopart.com:443/RG2012P-102-B-T5-Susumu-datasheet-12510050.pdf?src-supplier=Future+Electronics; ComponentLink6Description: https://datasheet.octopart.com:443/RG2012P-102-B-T5-Susumu-datasheet-12510050.pdf?src-supplier=Future+Electronics; ComponentLink7URL: https://datasheet.octopart.com:443/RG2012P-102-B-T5-Susumu-datasheet-8324184.pdf?src-supplier=Future+Electronics; ComponentLink7Description: https://datasheet.octopart.com:443/RG2012P-102-B-T5-Susumu-datasheet-8324184.pdf?src-supplier=Future+Electronics; ComponentLink8URL: https://datasheet.octopart.com:443/RG2012P-102-B-T5-Susumu-datasheet-118552.pdf?src-supplier=DigiKey; ComponentLink8Description: https://datasheet.octopart.com:443/RG2012P-102-B-T5-Susumu-datasheet-118552.pdf?src-supplier=DigiKey
R5 R6 R9-R11 R21 = RG2012P-103-B-T5: Res Thin Film 0805 10K Ohm 0.1% 0.125W(1/8W) ±25ppm/C Sulfur Resistant Pad SMD Automotive T/R; Manufacturer: Susumu; Power Dissipation: 125mW; Value: 10kΩ; Temperature Coefficient: 25ppm/°C; Voltage Rating: 150V; Supplier: DigiKey; Supplier Part Number: RG20P10.0KBCT-ND; Manufacturer Part Number: RG2012P-103-B-T5; RoHS: Compliant; Category: Chip SMD Resistors; Stock: 143311; Pricing: 1=0.1, 10=0.069, 25=0.0644, 50=0.0608, 100=0.0574, 250=0.05324, 500=0.05038, 1000=0.04774 (USD); Case/Package: 0805; Case Code (Imperial): 0805; Case Code (Metric): 2012; Composition: Thin Film; Country of Origin: Mainland China, Japan; Export Control Classification Number (ECCN) Code: EAR99; Height: 400µm; Harmonized Tariff Schedule (HTS) Code: 8533.21.00.30; Introduction Date: 2006-03-30; Lead Free: Lead Free; Length: 2mm; Lifecycle Status: Production; Max Operating Temperature: 155°C; Min Operating Temperature: -55°C; Mounting Technology: Surface Mount; Number of Terminals: 2; Number of Terminations: 2; Power Rating: 125mW; REACH SVHC: Yes; Termination: SMD/SMT; Tolerance: 0.1%; Voltage Rating (DC): 150V; Width: 1.25mm; Working Voltage: 150V; ComponentLink1URL: https://datasheet.octopart.com:443/RG2012P-103-B-T5-Susumu-datasheet-182148308.pdf?src-supplier=IHS; ComponentLink1Description: https://datasheet.octopart.com:443/RG2012P-103-B-T5-Susumu-datasheet-182148308.pdf?src-supplier=IHS; ComponentLink2URL: https://datasheet.octopart.com:443/RG2012P-103-B-T5-Susumu-datasheet-104167497.pdf?src-supplier=Upverter; ComponentLink2Description: https://datasheet.octopart.com:443/RG2012P-103-B-T5-Susumu-datasheet-104167497.pdf?src-supplier=Upverter; ComponentLink3URL: https://datasheet.octopart.com:443/RG2012P-103-B-T5-Susumu-datasheet-62085167.pdf?src-supplier=Upverter; ComponentLink3Description: https://datasheet.octopart.com:443/RG2012P-103-B-T5-Susumu-datasheet-62085167.pdf?src-supplier=Upverter; ComponentLink4URL: https://datasheet.octopart.com/RG2012P-103-B-T5-Susumu-datasheet-12509734.pdf; ComponentLink4Description: https://datasheet.octopart.com/RG2012P-103-B-T5-Susumu-datasheet-12509734.pdf; ComponentLink5URL: https://datasheet.octopart.com:443/RG2012P-103-B-T5-Susumu-datasheet-80324142.pdf?src-supplier=LKR; ComponentLink5Description: https://datasheet.octopart.com:443/RG2012P-103-B-T5-Susumu-datasheet-80324142.pdf?src-supplier=LKR; ComponentLink6URL: https://datasheet.octopart.com:443/RG2012P-103-B-T5-Susumu-datasheet-12510102.pdf?src-supplier=Future+Electronics; ComponentLink6Description: https://datasheet.octopart.com:443/RG2012P-103-B-T5-Susumu-datasheet-12510102.pdf?src-supplier=Future+Electronics; ComponentLink7URL: https://datasheet.octopart.com:443/RG2012P-103-B-T5-Susumu-datasheet-12510050.pdf?src-supplier=Future+Electronics; ComponentLink7Description: https://datasheet.octopart.com:443/RG2012P-103-B-T5-Susumu-datasheet-12510050.pdf?src-supplier=Future+Electronics; ComponentLink8URL: https://datasheet.octopart.com:443/RG2012P-103-B-T5-Susumu-datasheet-8324184.pdf?src-supplier=Future+Electronics; ComponentLink8Description: https://datasheet.octopart.com:443/RG2012P-103-B-T5-Susumu-datasheet-8324184.pdf?src-supplier=Future+Electronics; ComponentLink9URL: https://datasheet.octopart.com:443/RG2012P-103-B-T5-Susumu-datasheet-118552.pdf?src-supplier=DigiKey; ComponentLink9Description: https://datasheet.octopart.com:443/RG2012P-103-B-T5-Susumu-datasheet-118552.pdf?src-supplier=DigiKey
R12 = RG2012Q-270-D-T5: Fixed Resistor, Thin Film, 0.125W, 27ohm, 150V, 0.5% +/-Tol, 50ppm/Cel, Surface Mount, 0805; Manufacturer: Susumu; Power Dissipation: 125mW; Value: 27Ω; Temperature Coefficient: 50ppm/°C; Supplier: DigiKey; Supplier Part Number: 408-RG2012Q-270-D-T5CT-ND; Manufacturer Part Number: RG2012Q-270-D-T5; RoHS: Compliant; Category: Chip SMD Resistors; Stock: 8968; Pricing: 1=0.1, 10=0.055, 25=0.0508, 50=0.048, 100=0.0453, 250=0.04204, 500=0.03978, 1000=0.03768 (USD); Case/Package: 0805; Case Code (Imperial): 0805; Case Code (Metric): 2012; Composition: Thin Film; Country of Origin: Mainland China, Japan; Export Control Classification Number (ECCN) Code: EAR99; Height: 400µm; Harmonized Tariff Schedule (HTS) Code: 8533.21.00.30; Introduction Date: 2006-03-30; Lead Free: Lead Free; Length: 2mm; Lifecycle Status: Production; Max Operating Temperature: 155°C; Min Operating Temperature: -55°C; Mounting Technology: Surface Mount; Number of Terminals: 2; Packaging: Tape & Reel (TR); Power Rating: 125mW; REACH SVHC: Yes; Termination: SMD/SMT; Tolerance: 0.5%; Voltage Rating: 150V; Voltage Rating (DC): 150V; Width: 1.25mm; Working Voltage: 150V; ComponentLink1URL: https://datasheet.octopart.com:443/RG2012Q-270-D-T5-Susumu-datasheet-182148308.pdf?src-supplier=IHS; ComponentLink1Description: https://datasheet.octopart.com:443/RG2012Q-270-D-T5-Susumu-datasheet-182148308.pdf?src-supplier=IHS; ComponentLink2URL: https://datasheet.octopart.com:443/RG2012Q-270-D-T5-Susumu-datasheet-104167497.pdf?src-supplier=Upverter; ComponentLink2Description: https://datasheet.octopart.com:443/RG2012Q-270-D-T5-Susumu-datasheet-104167497.pdf?src-supplier=Upverter; ComponentLink3URL: https://datasheet.octopart.com:443/RG2012Q-270-D-T5-Susumu-datasheet-62085167.pdf?src-supplier=Future+Electronics; ComponentLink3Description: https://datasheet.octopart.com:443/RG2012Q-270-D-T5-Susumu-datasheet-62085167.pdf?src-supplier=Future+Electronics; ComponentLink4URL: https://datasheet.octopart.com:443/RG2012Q-270-D-T5-Susumu-datasheet-12510102.pdf?src-supplier=Future+Electronics; ComponentLink4Description: https://datasheet.octopart.com:443/RG2012Q-270-D-T5-Susumu-datasheet-12510102.pdf?src-supplier=Future+Electronics; ComponentLink5URL: https://datasheet.octopart.com:443/RG2012Q-270-D-T5-Susumu-datasheet-12510050.pdf?src-supplier=Future+Electronics; ComponentLink5Description: https://datasheet.octopart.com:443/RG2012Q-270-D-T5-Susumu-datasheet-12510050.pdf?src-supplier=Future+Electronics; ComponentLink6URL: https://datasheet.octopart.com/RG2012Q-270-D-T5-Susumu-datasheet-12509734.pdf; ComponentLink6Description: https://datasheet.octopart.com/RG2012Q-270-D-T5-Susumu-datasheet-12509734.pdf
SW1-SW3 = PTS645SH50SMTR92LFS: SWITCH TACTILE SPST-NO 0.05A 12V; Manufacturer: ITT C&K; Manufacturer Series: PTS645; Actuator Type: Pushbutton; Contact Current(DC)-Max: 50mA; Contact DC Max Rating R Load: 0.05A@12VDC; Contact Resistance: 0.1mR; Dielectric Withstand Volts: 250VACV; Electrical Life: 100000Cycles; Insulation Resistance: 100GR; PCB Hole Count: 4; Switch Action: MOMENTARY; Switch Function: SPST; Switch Type: Keypad; Body Breadth: 5.9944inch; Body Height: 3.4544mm; Body Length or Diameter: 5.9944mm; Supplier: Digikey; Supplier Part Number: CKN9085CT-ND; Manufacturer Part Number: PTS645SH50SMTR92LFS; RoHS: Yes; Category: Tactile Switches; Stock: 64637; Pricing: 1=0.35, 10=0.337, 25=0.3172, 100=0.2753, 250=0.24972, 500=0.2323 (USD); Mounting Technology: Surface Mount; Terminal Finish: Silver; Min Operating Temperature: -20°C; Max Operating Temperature: 60°C; JESD-609 Code: e4; Contact Voltage(DC)-Max: 12V; Termination: Solder; Terminal Length: 0.138inch; Reach SVHC Compliant: Yes; RoHS Compliant: Yes; ComponentLink1URL: https://datasheet.ciiva.com:443/pdfs/VipMasterIC/IC/CKCI/CKCI-S-A0001796527/CKCI-S-A0001796842-1.pdf?src-supplier=IHS+Markit; ComponentLink1Description: https://datasheet.ciiva.com:443/pdfs/VipMasterIC/IC/CKCI/CKCI-S-A0001796527/CKCI-S-A0001796842-1.pdf?src-supplier=IHS+Markit; ComponentLink2URL: https://datasheet.ciiva.com/29903/getdatasheetpartid-773702-29903807.pdf?src-supplier=Verical; ComponentLink2Description: https://datasheet.ciiva.com/29903/getdatasheetpartid-773702-29903807.pdf?src-supplier=Verical; ComponentLink3URL: https://datasheet.ciiva.com/14920/pts645-14920741.pdf?src-supplier=Digikey; ComponentLink3Description: https://datasheet.ciiva.com/14920/pts645-14920741.pdf?src-supplier=Digikey; ComponentLink4URL: https://datasheet.ciiva.com/22637/1707731-22637356.pdf?src-supplier=Element14; ComponentLink4Description: https://datasheet.ciiva.com/22637/1707731-22637356.pdf?src-supplier=Element14; LCSC Part Number: C221869